# EAGLE design frackstock_v1 (EAGLE 8.1.0)
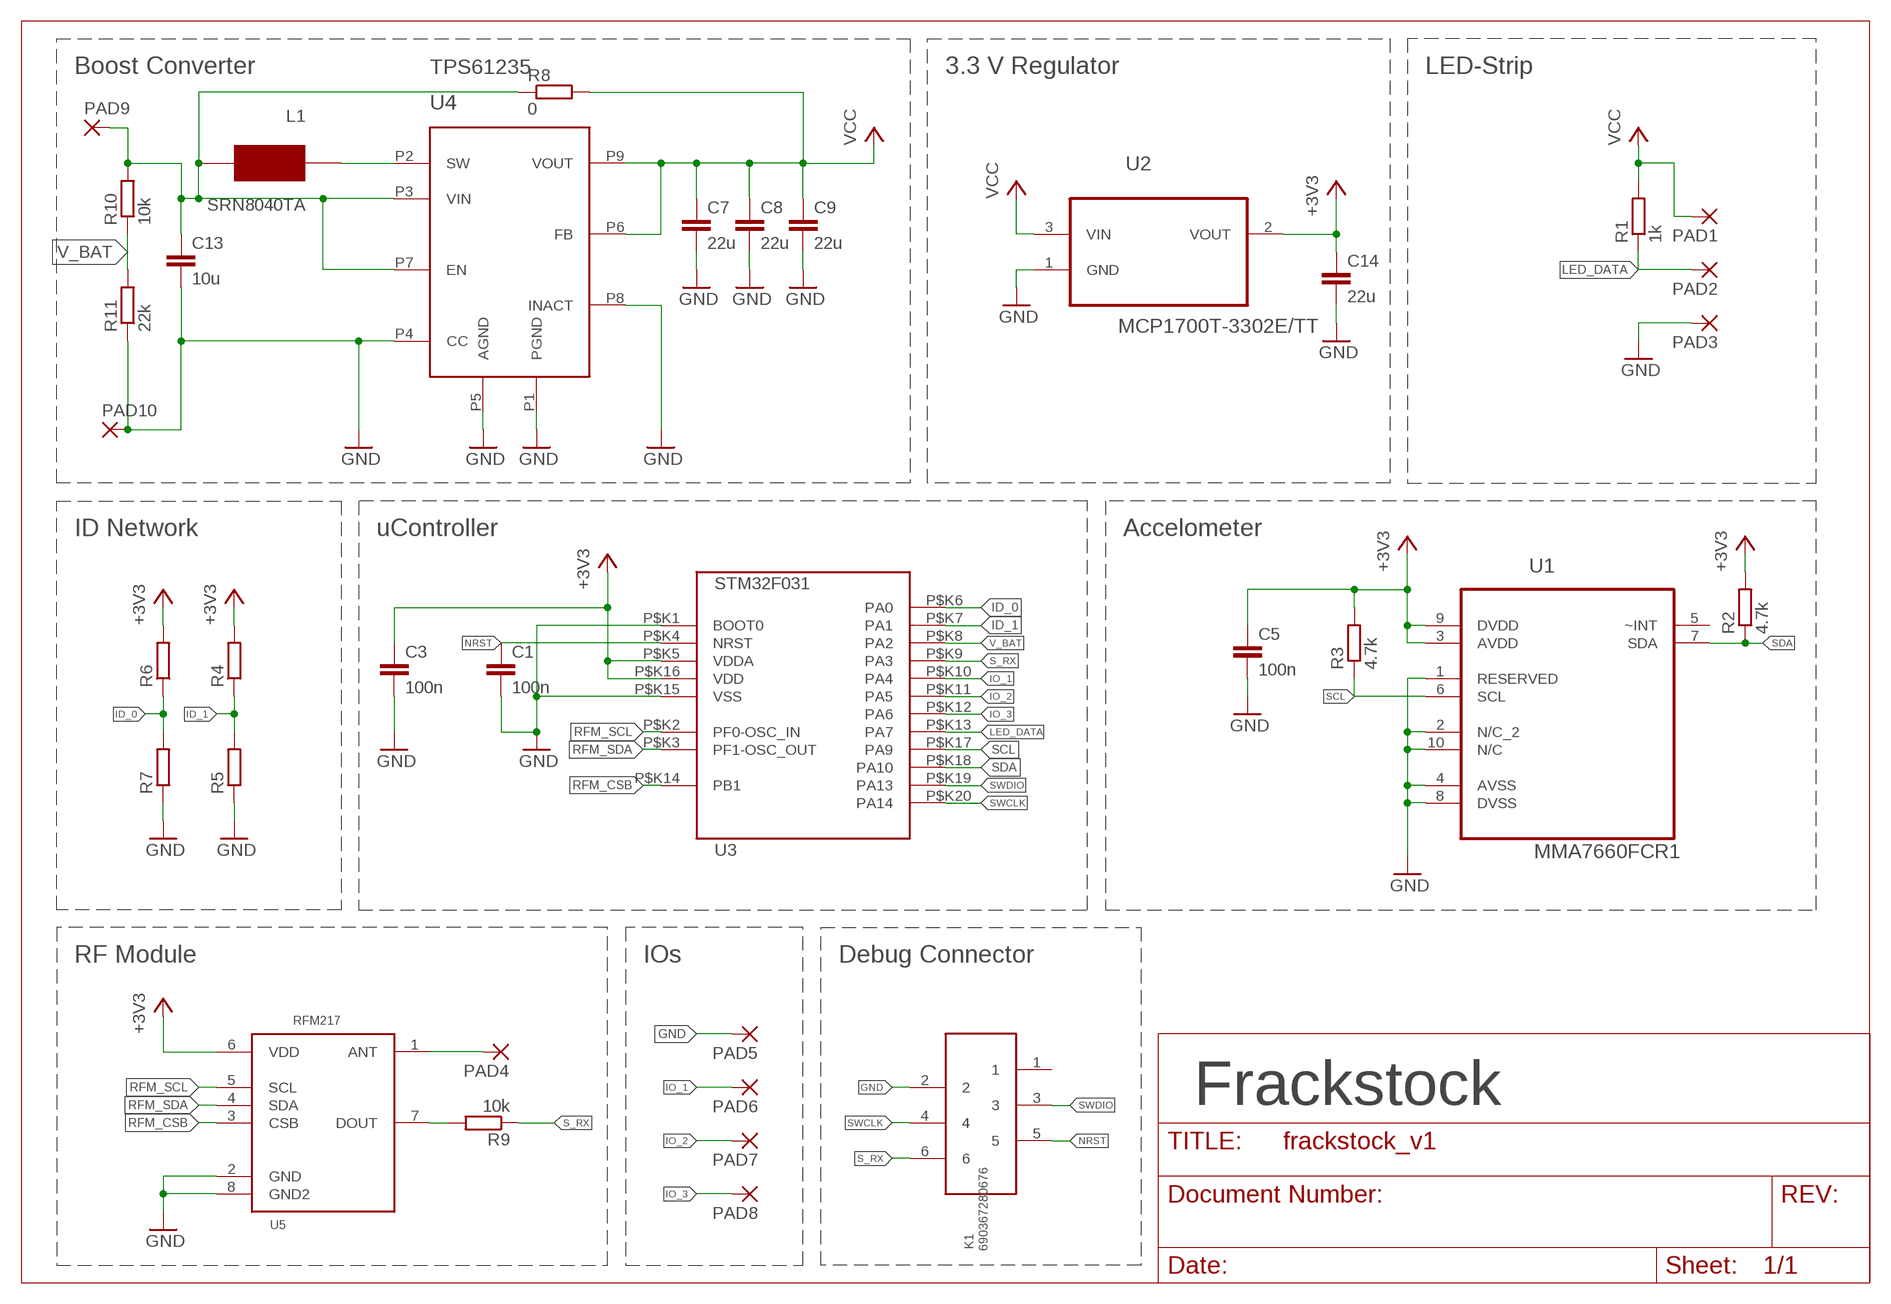
[diagram p0: schematic, sheet 1]

## Parts
C1  100n  C-EUC0603  [C0603]
C3  100n  C-EUC0603  [C0603]
C5  100n  C-EUC0603  [C0603]
C7  22u  C-EUC0805  [C0805]
C8  22u  C-EUC0805  [C0805]
C9  22u  C-EUC0805  [C0805]
C13  10u  C-EUC0805  [C0805]
C14  22u  C-EUC0603  [C0603]
K1  690367280676  [690367280676]
L1  SRN8040TA  [SRN8040TA_PACK]
PAD1  SMD5  [SMD2,54-5,08]
PAD2  SMD5  [SMD2,54-5,08]
PAD3  SMD5  [SMD2,54-5,08]
PAD4  SMD2  [SMD1,27-2,54]
PAD5  SMD2  [SMD1,27-2,54]
PAD6  SMD2  [SMD1,27-2,54]
PAD7  SMD2  [SMD1,27-2,54]
PAD8  SMD2  [SMD1,27-2,54]
PAD9  SMD5  [SMD2,54-5,08]
PAD10  SMD5  [SMD2,54-5,08]
R1  1k  R-EU_R0603  [R0603]
R2  4.7k  R-EU_R0603  [R0603]
R3  4.7k  R-EU_R0603  [R0603]
R4  R-EU_R0603  [R0603]
R5  R-EU_R0603  [R0603]
R6  R-EU_R0603  [R0603]
R7  R-EU_R0603  [R0603]
R8  0  R-EU_R1206  [R1206]
R9  10k  R-EU_R0603  [R0603]
R10  10k  R-EU_R0603  [R0603]
R11  22k  R-EU_R0603  [R0603]
U1  MMA7660FCR1  [DFN300X300X100-10N]
U2  MCP1700T-3302E/TT  [SOT95P237X112-3N]
U3  STM32F031  [TSSOP20]
U4  TPS61235  [VQFN]
U5  RFM217  [RFM217_PACK]

## Nets
+3V3: C3.1 C5.1 C14.1 R2.2 R3.2 R4.2 R6.2 U1.3(AVDD) U1.9(DVDD) U2.2(VOUT) U3.P$K5(VDDA) U3.P$K16(VDD) U5.6(VDD)
GND: C1.2 C3.2 C5.2 C7.2 C8.2 C9.2 C13.2 C14.2 K1.2 PAD3.1(P) PAD5.1(P) PAD10.1(P) R5.1 R7.1 R11.1 U1.1(RESERVED) U1.2(N/C_2) U1.4(AVSS) U1.8(DVSS) U1.10(N/C) U2.1(GND) U3.P$K1(BOOT0) U3.P$K15(VSS) U4.P1(PGND) U4.P4(CC) U4.P5(AGND) U4.P8(INACT) U5.2(GND) U5.8(GND2)
ID_0: R6.1 R7.2 U3.P$K6(PA0)
ID_1: R4.1 R5.2 U3.P$K7(PA1)
IO_1: PAD6.1(P) U3.P$K10(PA4)
IO_2: PAD7.1(P) U3.P$K11(PA5)
IO_3: PAD8.1(P) U3.P$K12(PA6)
LED_DATA: PAD2.1(P) R1.1 U3.P$K13(PA7)
N$1: R9.2 U5.7(DOUT)
N$2: PAD4.1(P) U5.1(ANT)
N$3: L1.2 U4.P2(SW)
N$5: C13.1 L1.1 PAD9.1(P) R8.1 R10.2 U4.P3(VIN) U4.P7(EN)
NRST: C1.1 K1.5 U3.P$K4(NRST)
RFM_CSB: U3.P$K14(PB1) U5.3(CSB)
RFM_SCL: U3.P$K2(PF0-OSC_IN) U5.5(SCL)
RFM_SDA: U3.P$K3(PF1-OSC_OUT) U5.4(SDA)
S_RX: K1.6 R9.1 U3.P$K9(PA3)
SCL: R3.1 U1.6(SCL) U3.P$K17(PA9)
SDA: R2.1 U1.7(SDA) U3.P$K18(PA10)
SWCLK: K1.4 U3.P$K20(PA14)
SWDIO: K1.3 U3.P$K19(PA13)
V_BAT: R10.1 R11.2 U3.P$K8(PA2)
VCC: C7.1 C8.1 C9.1 PAD1.1(P) R1.2 R8.2 U2.3(VIN) U4.P6(FB) U4.P9(VOUT)
Unconnected: K1.1 U1.5(~INT)

## Notes on the sheet
- Boost Converter | 3.3 V Regulator | LED-Strip
- ID Network | uController | Accelometer
- RF Module | IOs | Debug Connector
- Frackstock

## Library data of the parts
C1 C3 C5 C14 = rcl:C-EU: CAPACITOR, European symbol
C7-C9 C13 = resistor:C-EU: CAPACITOR, European symbol
K1 = Board_to_Board_Connectors_rev15d:690367280676: WR-MM Female SMT Connector with Polarization, 6 Pins=>Code : Con_BTB_MM_Female_SMT_690367280676 <http://katalog.we-online.de/media/thumbs2/eican/thb_Con_BTB_MM_Female_SMT_69036728xx76_pf2.jpg> Details see: http://katalog.we-online.de/en/em/6903_6728_xx_76 Created 2014-06-04, Karrer Zheng 2014 (C) Würth Elektronik
L1 = SRN8040TA:SRN8040TA
PAD1-PAD3 PAD9 PAD10 = wirepad:SMD5: SMD PAD
PAD4-PAD8 = wirepad:SMD2: SMD PAD
R1-R11 = resistor:R-EU_: RESISTOR, European symbol
U1 = MMA7660:MMA7660FCR1: Detection Sensor; MPN: MMA7660FCR1; OC_FARNELL: 2080493; OC_NEWARK: 74P0442; PACKAGE: DFN-10; SUPPLIER: FREESCALE SEMICONDUCTOR
U2 = MCP1700T:MCP1700T-3302E/TT: Low Quiescent Current LDO; MPN: MCP1700T-3302E/TT; OC_FARNELL: 1296592; OC_NEWARK: 88H9817; PACKAGE: SOT23-3; SUPPLIER: Microchip
U3 = stm32f031:STM32F031
U4 = TPS61235:TPS61235
U5 = RFM217:RFM217

## Board
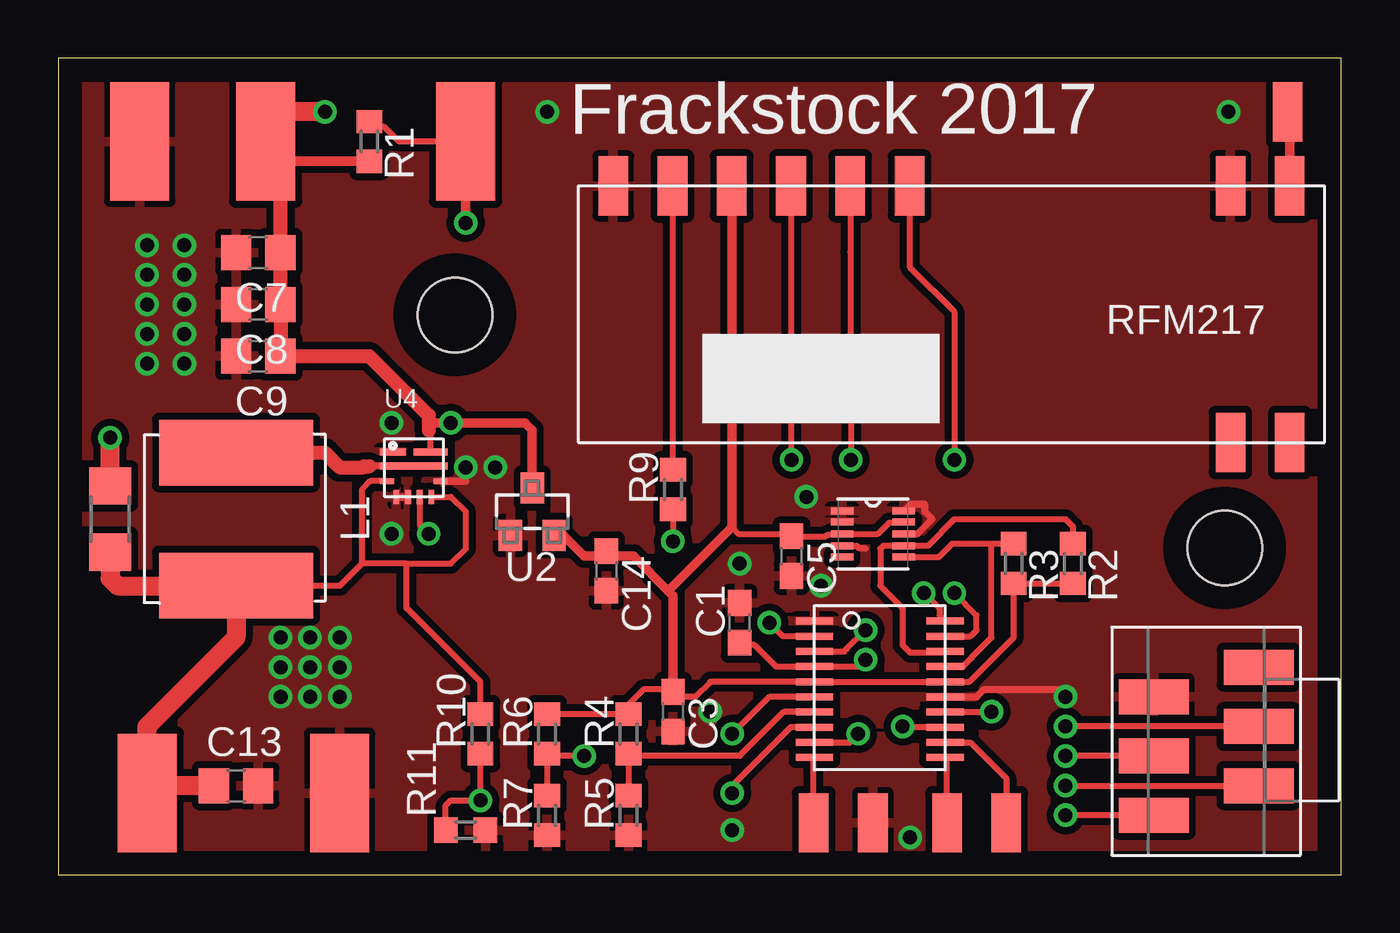
[diagram p1: board, top side]
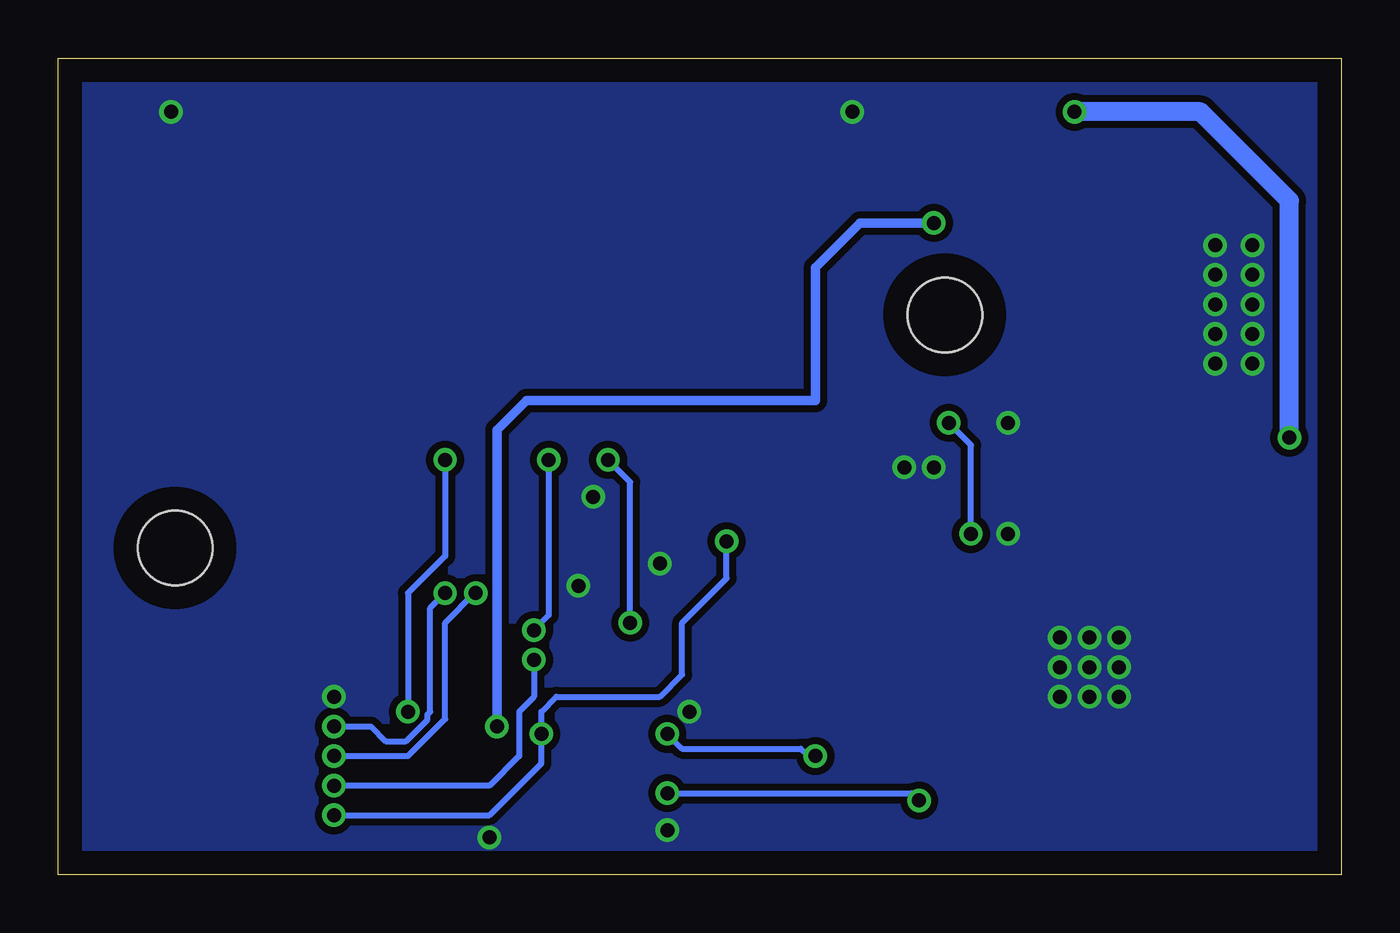
[diagram p2: board, bottom side, seen from below]

Size 55 x 35 mm. Coordinates in mm from the lower left corner, seen from the top.
Outline: 0,0 55,0 55,35 0,35 0,0
Copper layers (1*16): Top 0.035mm / dielectric 1.5mm / Bottom 0.035mm
Design rules "default *": minimum track width 6mil, minimum drill 10mil, track to track 6mil, track to pad 6mil, pad to pad 6mil, via to via 6mil, smd to smd 6mil, copper to edge 40mil, drill to drill 8mil, minimum pad ring 10mil, minimum via ring 8mil, stop-mask expansion 4mil, vias tented up to drill 0mil, thermal gap 10mil
Holes 3.2 mm at 50,14 17,24

### Footprints (pad centres in the part's own frame; a part is rotated, then mirrored left to right if it is on the bottom)
C0603 = smd 1.1 x 1: 1 -0.85,0; 2 0.85,0
C0805 = smd 1.3 x 1.5: 1 -0.95,0; 2 0.95,0
690367280676 = smd 1.5 x 3: 1 2.54,-2.25; 2 1.27,2.25; 3 0,-2.25; 4 -1.27,2.25; 5 -2.54,-2.25; 6 -3.81,2.25
SRN8040TA_PACK = smd 6.6 x 2.8: 1 0,-2.85; 2 0,2.85
SMD2,54-5,08 = smd 2.54 x 5.08: 1 0,0
SMD1,27-2,54 = smd 1.27 x 2.54: 1 0,0
R0603 = smd 1 x 1.1: 1 -0.85,0; 2 0.85,0
R1206 = smd 1.6 x 1.803: 1 -1.422,0; 2 1.422,0
DFN300X300X100-10N = smd 0.965 x 0.305: 1 -1.321,0.991; 2 -1.321,0.508; 3 -1.321,0; 4 -1.321,-0.508; 5 -1.321,-0.991; 6 1.321,-0.991; 7 1.321,-0.508; 8 1.321,0; 9 1.321,0.508; 10 1.321,0.991
SOT95P237X112-3N = smd 0.991 x 1.321: 1 -0.94,-1.016; 2 0.94,-1.016; 3 0,1.016
TSSOP20 = smd 0.3 x 1.6: P$K1 -2.93,-2.825; P$K2 -2.28,-2.825; P$K3 -1.63,-2.825; P$K4 -0.98,-2.825; P$K5 -0.33,-2.825; P$K6 0.32,-2.825; P$K7 0.97,-2.825; P$K8 1.62,-2.825; P$K9 2.27,-2.825; P$K10 2.92,-2.825; P$K11 2.92,2.775; P$K12 2.27,2.775; P$K13 1.62,2.775; P$K14 0.97,2.775; P$K15 0.32,2.775; P$K16 -0.33,2.775; P$K17 -0.98,2.775; P$K18 -1.63,2.775; P$K19 -2.28,2.775; P$K20 -2.93,2.775
VQFN = smd 1.1 x 0.3: P1 -0.9,1.92 | smd 2.9 x 0.3: P2 0,1.32 | smd 0.6 x 0.25: P3 -1.15,0.675; P8 1.15,0.675 | smd 0.25 x 0.6: P4 -0.75,0; P5 -0.25,0; P6 0.25,0; P7 0.75,0 | smd 1.45 x 0.3: P9 0.725,1.92
RFM217_PACK = smd 1.27 x 2.54: 1 1.5,0; 2 4.04,0; 3 17.8,0; 4 20.34,0; 5 22.88,0; 6 25.42,0; 7 27.96,0; 8 30.5,0; 10 4.04,11; 11 1.5,11

### Placement (x,y rotation side)
C1  29.21,10.79 90 top
C3  26.35,6.99 270 top
C5  31.43,13.65 270 top
C7  8.57,26.67 180 top
C8  8.57,24.45 180 top
C9  8.57,22.23 180 top
C13  7.62,3.81 0 top
C14  23.5,13.02 270 top
K1  49.21,6.35 90 top
L1  7.62,15.24 0 top
PAD1  8.89,31.43 0 top
PAD2  17.46,31.43 0 top
PAD3  3.49,31.43 0 top
PAD4  52.7,32.7 180 top
PAD5  34.92,2.22 0 top
PAD6  32.38,2.22 0 top
PAD7  38.1,2.22 180 top
PAD8  40.64,2.22 0 top
PAD9  3.81,3.49 180 top
PAD10  12.06,3.49 180 top
R1  13.34,31.43 270 top
R2  43.5,13.34 270 top
R3  40.96,13.34 270 top
R4  24.45,6.03 90 top
R5  24.45,2.54 90 top
R6  20.95,6.03 90 top
R7  20.95,2.54 90 top
R8  2.22,15.24 90 top
R9  26.35,16.51 90 top
R10  18.1,6.03 90 top
R11  17.46,1.91 180 top
U1  34.92,14.61 0 top
U2  20.32,15.56 0 top
U3  35.24,7.94 270 top
U4  15.24,16.19 0 top
U5  54.29,29.53 180 top

### Tracks (layer width: path | path; a pad name or v marks a point on that pad's centre or on a via)
+3V3
  Top 0.254: R6.2 R4.2 24.45,7.3 25.08,7.94 26.25,7.94 C3.1 26.57,7.62 27.3,7.62 27.95,8.27 U3.P$K5 U3.P$K16 39.06,8.27 40.96,10.16 R3.2 R2.2 | U1.9 36.22,15.09 35.63,15.09 35.14,14.61 U1.3 33.58,14.58 32.98,14.58 32.91,14.5 C5.1 31.33,14.61 29.17,14.61 28.87,14.9
  Top 0.406: U5.6 28.87,14.9 26.14,12.17 | 26.14,12.17 26.35,11.95 C3.1 | U2.2 21.65,14.54 22.54,13.65 23.28,13.65 C14.1 23.71,13.65 24.65,13.65 26.14,12.17
GND  (via drill 0.6)
  Top 0.254: U1.4 34.22,14.1 34.32,14 34.58,14 34.61,13.97
  Top 0.305: U1.8 36.83,14.61 37.47,15.24 37.15,15.56 37.15,15.88 36.52,15.88 U1.10 | U3.P$K15 39.37,7.62 39.69,7.94 43.18,7.94 v43.18,7.62 | U4.P4 U4.P5 | U4.P8 17.46,16.87 v17.46,17.46
  other vias: 3.81,24.45 3.81,25.72 3.81,26.99 5.4,26.99 5.4,25.72 5.4,24.45 5.4,23.18 3.81,23.18 3.81,21.91 5.4,21.91 9.53,10.16 10.79,10.16 12.06,10.16 9.53,8.89 10.79,8.89 12.06,8.89 9.53,7.62 10.79,7.62 12.06,7.62 27.94,6.99 29.21,13.34 28.89,1.91 14.29,19.37 18.73,17.46 32.7,12.38 32.07,16.19 50.16,32.7 20.95,32.7 14.29,14.61 36.51,1.59
  pour Top (isolate 0.305): 0,34.92 54.93,34.92 54.93,0 0,0
  pour Bottom (isolate 0.305): 0,34.92 54.93,34.92 54.93,0 0,0
ID_0  (via drill 0.6)
  Top 0.254: U3.P$K6 30.48,7.62 v28.89,6.03 | v22.54,5.08 21.06,5.08 R6.1 R7.2
  Bottom 0.254: v28.89,6.03 28.26,5.4 23.18,5.4 22.86,5.08 v22.54,5.08
ID_1
  Top 0.254: U3.P$K7 31.1,6.97 29.21,5.08 24.55,5.08 R4.1 R5.2
IO_1
  Top 0.254: PAD6.1 32.38,4.99 U3.P$K10
IO_2
  Top 0.254: PAD7.1 38.1,4.93 U3.P$K11
IO_3
  Top 0.254: U3.P$K12 39.1,5.67 40.64,4.13 PAD8.1
LED_DATA  (via drill 0.6)
  Top 0.254: U3.P$K13 36.23,6.32 v36.2,6.35 | PAD2.1 14.61,31.43 13.97,32.07 13.55,32.07 R1.1
  Top 0.406: v17.46,27.94 PAD2.1
  Bottom 0.406: v36.2,6.35 36.2,19.05 34.92,20.32 22.54,20.32 22.54,26.04 20.64,27.94 v17.46,27.94
N$1
  Top 0.254: R9.2 26.35,30.14 U5.7
N$2
  Top 0.406: U5.1 52.79,33.25 PAD4.1
N$3
  Top 0.254: 12.12,17.51 12.06,17.46
  Top 0.305: U4.P2 13.12,17.51 13.07,17.46
  Top 0.61: L1.2 11.44,18.09 12.06,17.46 13.07,17.46 13.11,17.5 13.34,17.5
N$5
  Top 0.254: U4.P3 13.38,16.87 13.02,16.51 13.02,13.34 | 13.02,13.34 12.06,12.38 L1.1 | U4.P7 16.83,16.19 17.46,15.56 17.46,13.97 16.83,13.34 14.92,13.34 | 14.92,13.34 13.02,13.34 | R10.2 18.1,8.26 14.92,11.43 14.92,13.34
  Top 0.813: C13.1 4.13,3.81 PAD9.1 3.81,6.35 7.62,10.16 L1.1 2.54,12.38 2.22,12.7 R8.1
NRST  (via drill 0.6)
  Top 0.254: C1.1 29.31,9.84 29.84,9.84 30.77,8.92 U3.P$K4 34.32,8.92 v34.61,9.21 | v43.18,3.81 K1.5
  Bottom 0.254: v34.61,9.21 34.61,7.62 35.24,6.99 35.24,5.08 36.51,3.81 v43.18,3.81
RFM_CSB  (via drill 0.6)
  Top 0.254: U3.P$K14 39.99,6.97 v40.01,6.99 | v38.42,17.78 38.42,24.13 36.51,26.04 36.51,30.14 U5.3
  Bottom 0.254: v38.42,17.78 38.42,13.65 40.01,12.06 v40.01,6.99
RFM_SCL  (via drill 0.6)
  Top 0.254: U3.P$K2 31.06,10.22 v30.48,10.79 | v31.43,17.78 31.43,30.14 U5.5
  Bottom 0.254: v30.48,10.79 30.48,16.83 v31.43,17.78
RFM_SDA  (via drill 0.6)
  Top 0.254: U5.4 33.95,26.69 v33.97,17.78 | U3.P$K3 33.69,9.57 33.78,9.66 33.8,9.66 v34.61,10.48
  Bottom 0.254: v34.61,10.48 33.97,11.11 v33.97,17.78
S_RX  (via drill 0.6)
  Top 0.254: U3.P$K9 33.92,5.67 v34.29,6.03 | K1.6 v43.18,2.54 | R9.1 v26.35,14.29
  Bottom 0.254: v43.18,2.54 36.51,2.54 34.29,4.76 v34.29,6.03 34.29,6.99 33.66,7.62 29.21,7.62 28.26,8.57 28.26,10.79 26.35,12.7 v26.35,14.29
SCL
  Top 0.254: R3.1 40.01,14.19 | U3.P$K17 38.78,8.92 39.15,9.28 39.15,9.3 40.01,10.16 40.01,14.19 | 37.74,13.61 37.78,13.65 | U1.6 37.74,13.61 | 40.01,14.19 38.31,14.19 37.74,13.61
SDA
  Top 0.254: U3.P$K18 37.98,9.53 36.51,9.53 36.2,9.84 36.2,11.43 35.24,12.38 35.24,13.97 35.37,14.1 U1.7 37.27,14.1 38.42,15.24 43.18,15.24 43.5,14.92 R2.1
SWCLK  (via drill 0.6)
  Top 0.254: K1.4 v43.18,5.08 | v37.1,12.06 37.15,12.06 37.78,11.43 37.78,11.1 U3.P$K20
  Bottom 0.254: v43.18,5.08 40.01,5.08 38.42,6.67 38.42,10.79 37.15,12.06 v37.1,12.06
SWDIO  (via drill 0.6)
  Top 0.254: K1.3 v43.18,6.35 | v38.42,12.06 39.37,11.11 39.37,10.48 39.11,10.22 U3.P$K19
  Bottom 0.254: v43.18,6.35 41.59,6.35 40.96,5.71 40.1,5.71 39.17,6.64 39.17,6.87 39.05,6.99 39.05,11.43 v38.42,12.06
V_BAT  (via drill 0.6)
  Top 0.254: U3.P$K8 31.4,6.32 28.89,3.81 v28.89,3.49 | R11.2 16.61,2.96 16.83,3.17 v18.1,3.17 R10.1
  Bottom 0.254: v28.89,3.49 18.41,3.49 v18.1,3.17
VCC  (via drill 0.6)
  Top 0.254: U4.P9 15.96,18.96 15.88,19.05 | U4.P6 15.49,14.99 v15.88,14.61
  Top 0.406: 15.88,19.37 v16.83,19.37 20,19.37 20.32,19.05 U2.3 | R1.2 9.74,30.58 PAD1.1
  Top 0.61: 15.88,19.05 15.88,19.37 15.88,19.68 13.34,22.23 C9.1 C8.1 C7.1 9.52,30.8 PAD1.1
  Top 0.813: R8.2 v2.22,18.73 | v11.43,32.7 9.21,32.7 8.89,32.38 PAD1.1
  Bottom 0.254: v15.88,14.61 15.88,18.41 v16.83,19.37
  Bottom 0.813: v2.22,18.73 2.22,28.89 6.03,32.7 v11.43,32.7

### Text on the board
tNames: Frackstock 2017